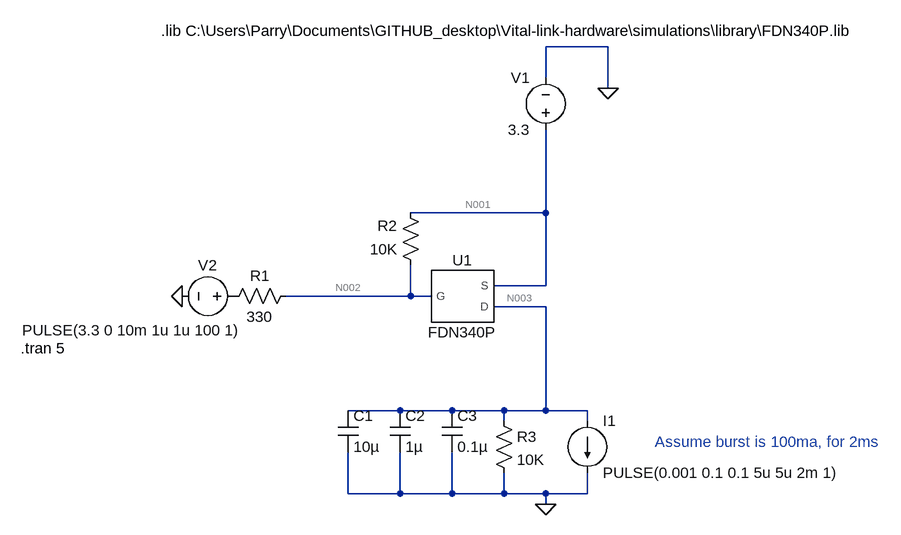
[diagram p0: schematic SSD_LOAD_SWITCH.asc]
SSD_LOAD_SWITCH.asc, the LTspice schematic file:
Version 4.1
SHEET 1 1260 852
WIRE 736 128 640 128
WIRE 640 176 640 128
WIRE 736 192 736 128
WIRE 640 384 640 256
WIRE 640 384 432 384
WIRE 640 496 640 384
WIRE 640 496 560 496
WIRE 432 512 432 464
WIRE 432 512 240 512
WIRE 464 512 432 512
WIRE 640 528 560 528
WIRE 416 688 336 688
WIRE 496 688 416 688
WIRE 576 688 496 688
WIRE 640 688 640 528
WIRE 640 688 576 688
WIRE 704 688 640 688
WIRE 576 704 576 688
WIRE 704 704 704 688
WIRE 336 816 336 752
WIRE 416 816 416 752
WIRE 416 816 336 816
WIRE 496 816 496 752
WIRE 496 816 416 816
WIRE 576 816 576 784
WIRE 576 816 496 816
WIRE 640 816 576 816
WIRE 704 816 704 784
WIRE 704 816 640 816
WIRE 640 832 640 816
FLAG 640 832 0
FLAG 736 192 0
FLAG 80 512 0
SYMBOL voltage 640 272 R180
WINDOW 0 24 96 Left 2
WINDOW 3 24 16 Left 2
WINDOW 123 0 0 Left 0
WINDOW 39 0 0 Left 0
SYMATTR InstName V1
SYMATTR Value 3.3
SYMBOL res 256 496 R90
WINDOW 0 0 56 VBottom 2
WINDOW 3 32 56 VTop 2
SYMATTR InstName R1
SYMATTR Value 330
SYMBOL res 448 480 R180
WINDOW 0 36 76 Left 2
WINDOW 3 36 40 Left 2
SYMATTR InstName R2
SYMATTR Value 10K
SYMBOL voltage 176 512 R90
WINDOW 0 -32 56 VBottom 2
WINDOW 3 37 173 VTop 2
WINDOW 123 0 0 Left 0
WINDOW 39 0 0 Left 0
SYMATTR InstName V2
SYMATTR Value PULSE(3.3 0 10m 1u 1u 100 1)
SYMBOL current 704 704 R0
WINDOW 123 0 0 Left 0
WINDOW 39 0 0 Left 0
SYMATTR InstName I1
SYMATTR Value PULSE(0.001 0.1 0.1 5u 5u 2m 1)
SYMBOL library\\FDN340P 512 512 R0
SYMATTR InstName U1
SYMBOL cap 320 688 R0
SYMATTR InstName C1
SYMATTR Value 10µ
SYMBOL cap 480 688 R0
SYMATTR InstName C3
SYMATTR Value 0.1µ
SYMBOL cap 400 688 R0
SYMATTR InstName C2
SYMATTR Value 1µ
SYMBOL res 560 688 R0
SYMATTR InstName R3
SYMATTR Value 10K
TEXT 48 104 Left 2 !.lib C:\\Users\\Parry\\Documents\\GITHUB_desktop\\Vital-link-hardware\\simulations\\library\\FDN340P.lib
TEXT 808 736 Left 2 ;Assume burst is 100ma, for 2ms
TEXT -168 592 Left 2 !.tran 5

The netlist it stands for:
* SSD_LOAD_SWITCH.asc
V1 N001 0 3.3
R1 N002 P001 330
R2 N002 N001 10K
V2 P001 0 PULSE(3.3 0 10m 1u 1u 100 1)
I1 N003 0 PULSE(0.001 0.1 0.1 5u 5u 2m 1)
X§U1 N002 N003 N001 FDN340P  ; pins G D S
C1 N003 0 10µ
C3 N003 0 0.1µ
C2 N003 0 1µ
R3 N003 0 10K
.lib C:\Users\Parry\Documents\GITHUB_desktop\Vital-link-hardware\simulations\library\FDN340P.lib
* Assume burst is 100ma, for 2ms
.tran 5
.lib C:\Users\Parry\Documents\GITHUB_desktop\Vital-link-hardware\simulations\library\FDN340P.lib
.backanno
.end

* Results of the author's LTspice run, read from the files saved beside the schematic
* Operating Point, zero values left out:
*   V(n002) = 3.3 V
*   V(n003) = -9.987 V
*   V(n001) = 3.3 V
*   V(p001) = 3.3 V
*   I(V1) = -1.329 µA
*   I(R2) = -3.924 pA
*   I(I1) = 1 mA
*   I(R3) = -998.7 µA
*   I(R1) = -118.9 pA
*   I(V2) = -118.9 pA
*   Ix(u1:20) = 122.8 pA
*   Ix(u1:10) = -1.329 µA
*   Ix(u1:30) = 1.329 µA
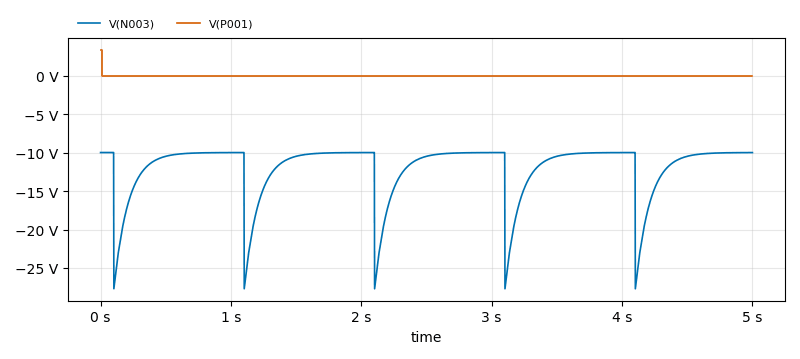
[diagram p1: Transient Analysis of SSD_LOAD_SWITCH.asc, plotted from the saved traces]
* Transient Analysis, 1 run:
*   V(N003): min -27.71 V, max -9.987 V, average -11.98 V, rms 12.56 V, last -9.992 V
*   V(P001): min 0 V, max 3.3 V, average 6.6 mV, rms 147.6 mV, last 0 V